# Altium schematic sheet mcu.SchDoc: SCOPE-F07x: mcu
size A4; DrawnBy: OldGerman; Organization: Draw By: OldGerman; Address2: https://github.com; Address3: /oldgerman/SCOPE-F07x; Revision: v1.1; SheetNumber: 3; SheetTotal: 5
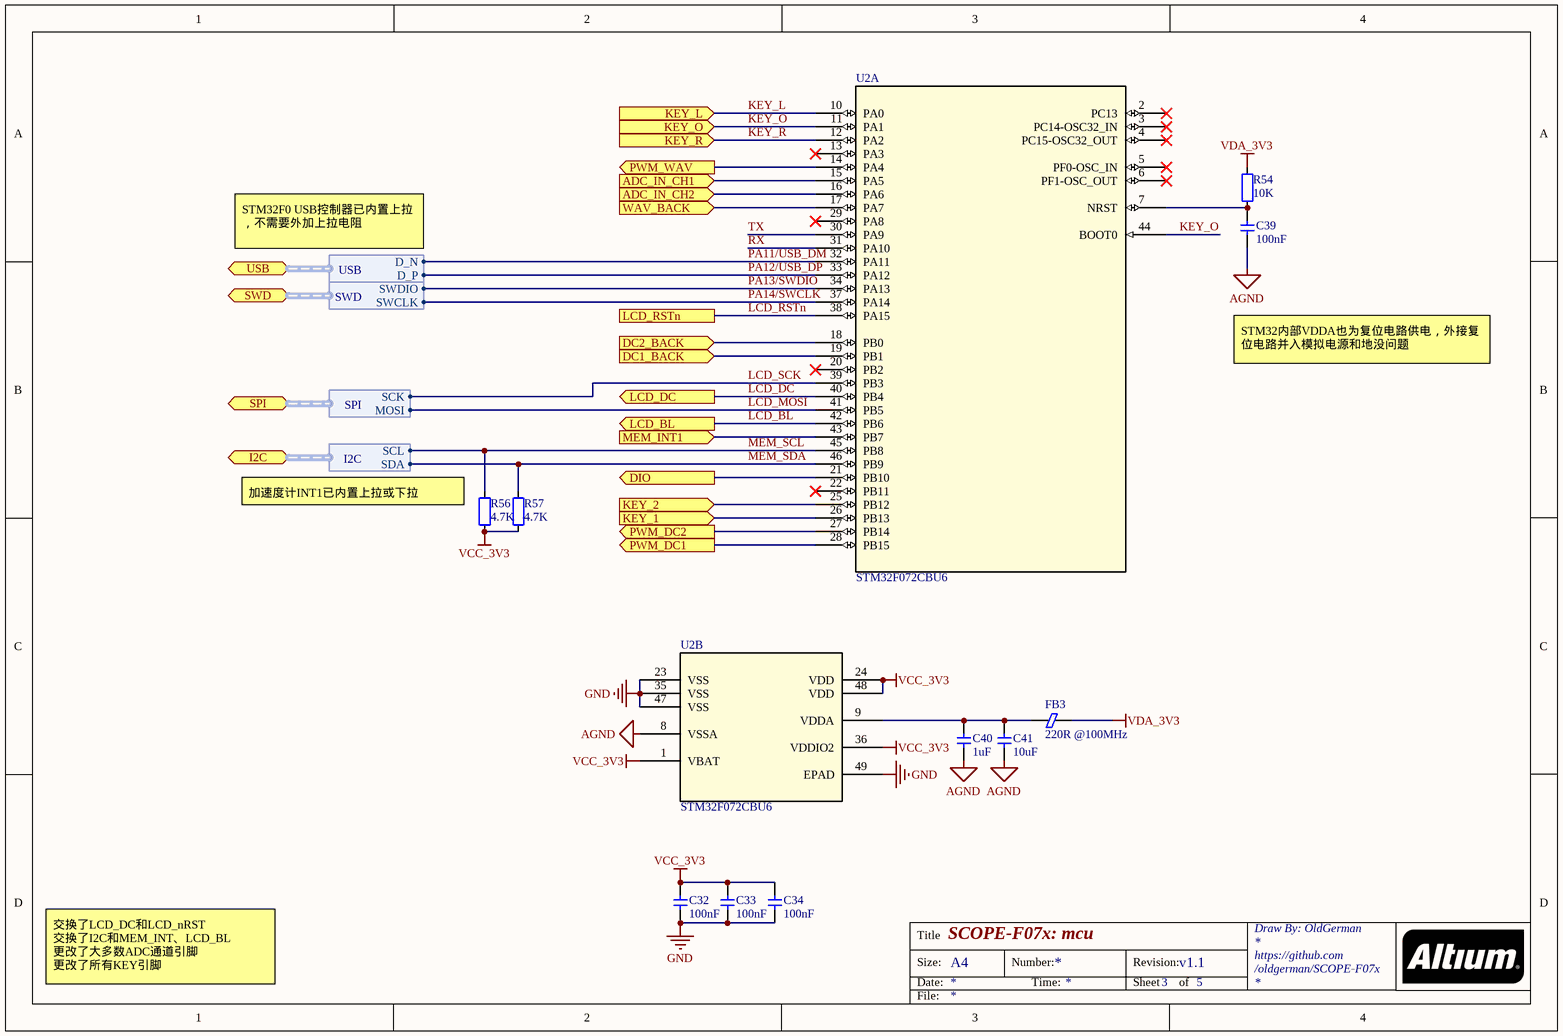
[diagram p0: mcu.SchDoc]

## Parts
C32  100nF  [C0402]
C33  100nF  [C0402]
C34  100nF  [C0402]
C39  100nF  [C0402]
C40  1uF  [C0402]
C41  10uF  [C0402]
FB3  220R @100MHz  [FER0402]
R54  10K  [R0402]
R56  4.7K  [R0402]
R57  4.7K  [R0402]
U2  STM32F072CBU6  [UFQFPN-48_7X7X0P55MM_VIA]  (parts A,B of 2)

## Ports
ADC_IN_CH1 (in), ADC_IN_CH2 (in), DC1_BACK (in), DC2_BACK (in), DIO (out), I2C (bidir, harness I2C), KEY_1 (in), KEY_2 (in), KEY_L (in), KEY_O (in), KEY_R (in), LCD_BL (out), LCD_DC (out), LCD_RSTn, MEM_INT1 (in), PWM_DC1 (out), PWM_DC2 (out), PWM_WAV (out), SPI (bidir, harness SPI), SWD (bidir, harness SWD), USB (bidir, harness USB), WAV_BACK (in)

## Harnesses
USB: D_P, D_N
SWD: SWCLK, SWDIO
I2C: SDA, SCL
SPI: MOSI, SCK

## Nets
AGND: C39.2 C40.2 C41.2 U2.8(VSSA)
GND: C32.2 C33.2 C34.2 U2.23(VSS) U2.35(VSS) U2.47(VSS) U2.49(EPAD)
VCC_3V3: C32.1 C33.1 C34.1 R56.1 R57.1 U2.1(VBAT) U2.24(VDD) U2.36(VDDIO2) U2.48(VDD)
VDA_3V3: FB3.1 R54.1
ADC_IN_CH1: U2.15(PA5) ; port ADC_IN_CH1
ADC_IN_CH2: U2.16(PA6) ; port ADC_IN_CH2
DC1_BACK: U2.19(PB1) ; port DC1_BACK
DC2_BACK: U2.18(PB0) ; port DC2_BACK
DIO: U2.21(PB10) ; port DIO
KEY_1: U2.26(PB13) ; port KEY_1
KEY_2: U2.25(PB12) ; port KEY_2
KEY_L: U2.10(PA0) ; port KEY_L
KEY_O: U2.11(PA1) U2.44(BOOT0) ; port KEY_O
KEY_R: U2.12(PA2) ; port KEY_R
LCD_BL: U2.42(PB6) ; port LCD_BL
LCD_DC: U2.40(PB4) ; port LCD_DC
LCD_MOSI: U2.41(PB5) ; port SPI.MOSI
LCD_RSTn: U2.38(PA15) ; port LCD_RSTn
LCD_SCK: U2.39(PB3) ; port SPI.SCK
MEM_INT1: U2.43(PB7) ; port MEM_INT1
MEM_SCL: R56.2 U2.45(PB8) ; port I2C.SCL
MEM_SDA: R57.2 U2.46(PB9) ; port I2C.SDA
PA11/USB_DM: U2.32(PA11) ; port USB.D_N
PA12/USB_DP: U2.33(PA12) ; port USB.D_P
PA13/SWDIO: U2.34(PA13) ; port SWD.SWDIO
PA14/SWCLK: U2.37(PA14) ; port SWD.SWCLK
PWM_DC1: U2.28(PB15) ; port PWM_DC1
PWM_DC2: U2.27(PB14) ; port PWM_DC2
PWM_WAV: U2.14(PA4) ; port PWM_WAV
RX: U2.31(PA10)
TX: U2.30(PA9)
WAV_BACK: U2.17(PA7) ; port WAV_BACK
NetC39_1: C39.1 R54.2 U2.7(NRST)
NetC40_1: C40.1 C41.1 FB3.2 U2.9(VDDA)

Not connected (* = marked no-connect by the designer): U2 2(PC13)* 3(PC14-OSC32_IN)* 4(PC15-OSC32_OUT)* 5(PF0-OSC_IN)* 6(PF1-OSC_OUT)* 13(PA3)* 20(PB2)* 22(PB11)* 29(PA8)*

## Notes on the sheet
- STM32F0 USB控制器已内置上拉，不需要外加上拉电阻
- STM32内部VDDA也为复位电路供电，外接复位电路并入模拟电源和地没问题
- (near R56) 加速度计INT1已内置上拉或下拉
- 交换了LCD_DC和LCD_nRST
  交换了I2C和MEM_INT、LCD_BL
  更改了大多数ADC通道引脚
  更改了所有KEY引脚
- Title
- Size:
- Date:
- A4
- Number:
- Time:
- Revision:
- Sheet
- of
- File:

## Library data of the parts
C32-C34 C39-C41 = CAP: Capacitor; Value: 0.1u
FB3 = Ferrite: 磁珠
R54 R56 R57 = RES: Resistor; Value: 22R
U2 = STM32F072CBU6: Mainstream Arm Cortex-M0 USB line MCU with 128 Kbytes of Flash memory, 48 MHz CPU, USB, CAN and CEC functions; Mfr_Name: STMicroelectronics; Copyright: Copyright (C) 2022 Ultra Librarian. All rights reserved.; Manufacturer_Part_Number: STM32F072CBU6; RefDes: RefDes; Type: DEV